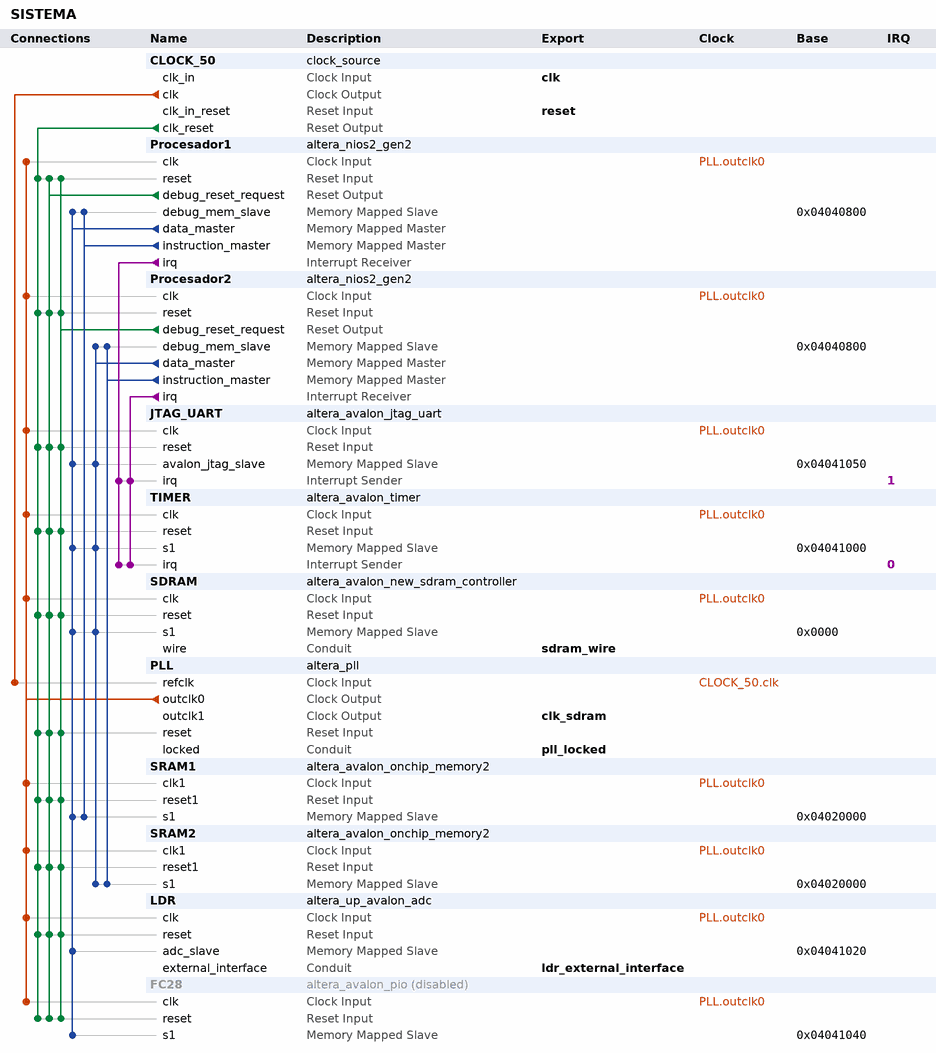
[diagram p0: system contents]
# Platform Designer (Qsys) system SISTEMA, Cyclone V 5CSXFC6D6F31C6
# Parameters at their usual value, and those the tool derives, are not listed.
package require -exact qsys 17.0
create_system SISTEMA
set_project_property DEVICE_FAMILY {Cyclone V}
set_project_property DEVICE 5CSXFC6D6F31C6

add_instance CLOCK_50 clock_source 17.0
set_instance_parameter_value CLOCK_50 clockFrequency 50000000

add_instance Procesador1 altera_nios2_gen2 17.0
set_instance_parameter_value Procesador1 cpuID 1
set_instance_parameter_value Procesador1 dcache_size 2048
set_instance_parameter_value Procesador1 exceptionSlave SRAM1.s1
set_instance_parameter_value Procesador1 icache_size 4096
set_instance_parameter_value Procesador1 impl Tiny
set_instance_parameter_value Procesador1 resetSlave SRAM1.s1

add_instance Procesador2 altera_nios2_gen2 17.0
set_instance_parameter_value Procesador2 cpuID 2
set_instance_parameter_value Procesador2 dcache_size 2048
set_instance_parameter_value Procesador2 exceptionSlave SRAM2.s1
set_instance_parameter_value Procesador2 icache_size 4096
set_instance_parameter_value Procesador2 impl Tiny
set_instance_parameter_value Procesador2 resetSlave SRAM2.s1

add_instance JTAG_UART altera_avalon_jtag_uart 17.0
set_instance_parameter_value JTAG_UART simInteractiveOptions NO_INTERACTIVE_WINDOWS

add_instance TIMER altera_avalon_timer 17.0
set_instance_parameter_value TIMER period 1
set_instance_parameter_value TIMER periodUnits MSEC

add_instance SDRAM altera_avalon_new_sdram_controller 17.0
set_instance_parameter_value SDRAM TAC 5.4
set_instance_parameter_value SDRAM TRCD 15.0
set_instance_parameter_value SDRAM TRP 15.0
set_instance_parameter_value SDRAM casLatency 3
set_instance_parameter_value SDRAM columnWidth 10
set_instance_parameter_value SDRAM dataWidth 16
set_instance_parameter_value SDRAM generateSimulationModel true
set_instance_parameter_value SDRAM model single_Micron_MT48LC4M32B2_7_chip
set_instance_parameter_value SDRAM numberOfBanks 4
set_instance_parameter_value SDRAM numberOfChipSelects 1
set_instance_parameter_value SDRAM powerUpDelay 100.0
set_instance_parameter_value SDRAM refreshPeriod 7.8125
set_instance_parameter_value SDRAM rowWidth 13

add_instance PLL altera_pll 17.0
set_instance_parameter_value PLL gui_device_speed_grade 2
set_instance_parameter_value PLL gui_number_of_clocks 2
set_instance_parameter_value PLL gui_operation_mode normal
set_instance_parameter_value PLL gui_output_clock_frequency0 100.0
set_instance_parameter_value PLL gui_output_clock_frequency1 100.0
set_instance_parameter_value PLL gui_phase_shift1 -3800
set_instance_parameter_value PLL gui_pll_mode {Integer-N PLL}
set_instance_parameter_value PLL gui_reference_clock_frequency 50.0
set_instance_parameter_value PLL gui_use_locked true

add_instance SRAM1 altera_avalon_onchip_memory2 17.0
set_instance_parameter_value SRAM1 dataWidth 32
set_instance_parameter_value SRAM1 dualPort false
set_instance_parameter_value SRAM1 initMemContent true
set_instance_parameter_value SRAM1 initializationFileName onchip_mem.hex
set_instance_parameter_value SRAM1 memorySize 128000

add_instance SRAM2 altera_avalon_onchip_memory2 17.0
set_instance_parameter_value SRAM2 dataWidth 32
set_instance_parameter_value SRAM2 dualPort false
set_instance_parameter_value SRAM2 initMemContent true
set_instance_parameter_value SRAM2 initializationFileName onchip_mem.hex
set_instance_parameter_value SRAM2 memorySize 128000

add_instance LDR altera_up_avalon_adc 17.0
set_instance_parameter_value LDR board DE1-SoC
set_instance_parameter_value LDR numch_ 4

add_instance FC28 altera_avalon_pio 17.0
set_instance_property FC28 ENABLED false
set_instance_parameter_value FC28 direction Input
set_instance_parameter_value FC28 width 1

# connections
add_connection CLOCK_50.clk PLL.refclk clock
add_connection PLL.outclk0 FC28.clk clock
add_connection PLL.outclk0 JTAG_UART.clk clock
add_connection PLL.outclk0 LDR.clk clock
add_connection PLL.outclk0 Procesador1.clk clock
add_connection PLL.outclk0 Procesador2.clk clock
add_connection PLL.outclk0 SDRAM.clk clock
add_connection PLL.outclk0 SRAM1.clk1 clock
add_connection PLL.outclk0 SRAM2.clk1 clock
add_connection PLL.outclk0 TIMER.clk clock
add_connection CLOCK_50.clk_reset FC28.reset reset
add_connection CLOCK_50.clk_reset JTAG_UART.reset reset
add_connection CLOCK_50.clk_reset LDR.reset reset
add_connection CLOCK_50.clk_reset PLL.reset reset
add_connection CLOCK_50.clk_reset Procesador1.reset reset
add_connection CLOCK_50.clk_reset Procesador2.reset reset
add_connection CLOCK_50.clk_reset SDRAM.reset reset
add_connection CLOCK_50.clk_reset SRAM1.reset1 reset
add_connection CLOCK_50.clk_reset SRAM2.reset1 reset
add_connection CLOCK_50.clk_reset TIMER.reset reset
add_connection Procesador1.debug_reset_request FC28.reset reset
add_connection Procesador1.debug_reset_request JTAG_UART.reset reset
add_connection Procesador1.debug_reset_request LDR.reset reset
add_connection Procesador1.debug_reset_request PLL.reset reset
add_connection Procesador1.debug_reset_request Procesador1.reset reset
add_connection Procesador1.debug_reset_request Procesador2.reset reset
add_connection Procesador1.debug_reset_request SDRAM.reset reset
add_connection Procesador1.debug_reset_request SRAM1.reset1 reset
add_connection Procesador1.debug_reset_request SRAM2.reset1 reset
add_connection Procesador1.debug_reset_request TIMER.reset reset
add_connection Procesador2.debug_reset_request FC28.reset reset
add_connection Procesador2.debug_reset_request JTAG_UART.reset reset
add_connection Procesador2.debug_reset_request LDR.reset reset
add_connection Procesador2.debug_reset_request PLL.reset reset
add_connection Procesador2.debug_reset_request Procesador1.reset reset
add_connection Procesador2.debug_reset_request Procesador2.reset reset
add_connection Procesador2.debug_reset_request SDRAM.reset reset
add_connection Procesador2.debug_reset_request SRAM1.reset1 reset
add_connection Procesador2.debug_reset_request SRAM2.reset1 reset
add_connection Procesador2.debug_reset_request TIMER.reset reset
add_connection Procesador1.data_master FC28.s1 avalon
set_connection_parameter_value Procesador1.data_master/FC28.s1 baseAddress 0x04041040
add_connection Procesador1.data_master JTAG_UART.avalon_jtag_slave avalon
set_connection_parameter_value Procesador1.data_master/JTAG_UART.avalon_jtag_slave baseAddress 0x04041050
add_connection Procesador1.data_master LDR.adc_slave avalon
set_connection_parameter_value Procesador1.data_master/LDR.adc_slave baseAddress 0x04041020
add_connection Procesador1.data_master Procesador1.debug_mem_slave avalon
set_connection_parameter_value Procesador1.data_master/Procesador1.debug_mem_slave baseAddress 0x04040800
add_connection Procesador1.data_master SDRAM.s1 avalon
set_connection_parameter_value Procesador1.data_master/SDRAM.s1 baseAddress 0x0000
add_connection Procesador1.data_master SRAM1.s1 avalon
set_connection_parameter_value Procesador1.data_master/SRAM1.s1 baseAddress 0x04020000
add_connection Procesador1.data_master TIMER.s1 avalon
set_connection_parameter_value Procesador1.data_master/TIMER.s1 baseAddress 0x04041000
add_connection Procesador1.instruction_master Procesador1.debug_mem_slave avalon
set_connection_parameter_value Procesador1.instruction_master/Procesador1.debug_mem_slave baseAddress 0x04040800
add_connection Procesador1.instruction_master SRAM1.s1 avalon
set_connection_parameter_value Procesador1.instruction_master/SRAM1.s1 baseAddress 0x04020000
add_connection Procesador2.data_master JTAG_UART.avalon_jtag_slave avalon
set_connection_parameter_value Procesador2.data_master/JTAG_UART.avalon_jtag_slave baseAddress 0x04041050
add_connection Procesador2.data_master Procesador2.debug_mem_slave avalon
set_connection_parameter_value Procesador2.data_master/Procesador2.debug_mem_slave baseAddress 0x04040800
add_connection Procesador2.data_master SDRAM.s1 avalon
set_connection_parameter_value Procesador2.data_master/SDRAM.s1 baseAddress 0x0000
add_connection Procesador2.data_master SRAM2.s1 avalon
set_connection_parameter_value Procesador2.data_master/SRAM2.s1 baseAddress 0x04020000
add_connection Procesador2.data_master TIMER.s1 avalon
set_connection_parameter_value Procesador2.data_master/TIMER.s1 baseAddress 0x04041000
add_connection Procesador2.instruction_master Procesador2.debug_mem_slave avalon
set_connection_parameter_value Procesador2.instruction_master/Procesador2.debug_mem_slave baseAddress 0x04040800
add_connection Procesador2.instruction_master SRAM2.s1 avalon
set_connection_parameter_value Procesador2.instruction_master/SRAM2.s1 baseAddress 0x04020000
add_connection Procesador1.irq JTAG_UART.irq interrupt
set_connection_parameter_value Procesador1.irq/JTAG_UART.irq irqNumber 1
add_connection Procesador1.irq TIMER.irq interrupt
set_connection_parameter_value Procesador1.irq/TIMER.irq irqNumber 0
add_connection Procesador2.irq JTAG_UART.irq interrupt
set_connection_parameter_value Procesador2.irq/JTAG_UART.irq irqNumber 1
add_connection Procesador2.irq TIMER.irq interrupt
set_connection_parameter_value Procesador2.irq/TIMER.irq irqNumber 0

# exported interfaces
add_interface clk clock sink
set_interface_property clk EXPORT_OF CLOCK_50.clk_in
add_interface clk_sdram clock source
set_interface_property clk_sdram EXPORT_OF PLL.outclk1
add_interface ldr_external_interface conduit end
set_interface_property ldr_external_interface EXPORT_OF LDR.external_interface
add_interface pll_locked conduit end
set_interface_property pll_locked EXPORT_OF PLL.locked
add_interface reset reset sink
set_interface_property reset EXPORT_OF CLOCK_50.clk_in_reset
add_interface sdram_wire conduit end
set_interface_property sdram_wire EXPORT_OF SDRAM.wire

set_interconnect_requirement {$system} qsys_mm.clockCrossingAdapter HANDSHAKE
set_interconnect_requirement {$system} qsys_mm.enableEccProtection FALSE
set_interconnect_requirement {$system} qsys_mm.insertDefaultSlave FALSE
set_interconnect_requirement {$system} qsys_mm.maxAdditionalLatency 1

save_system SISTEMA.qsys
